# Altium schematic sheet DC TO DC.SchDoc: DC TO DC CONVERTER
size A4; Date: 08/11/2025; CompanyName: MR; DrawnBy: Rajasekhar; SheetNumber: 1; SheetTotal: 1
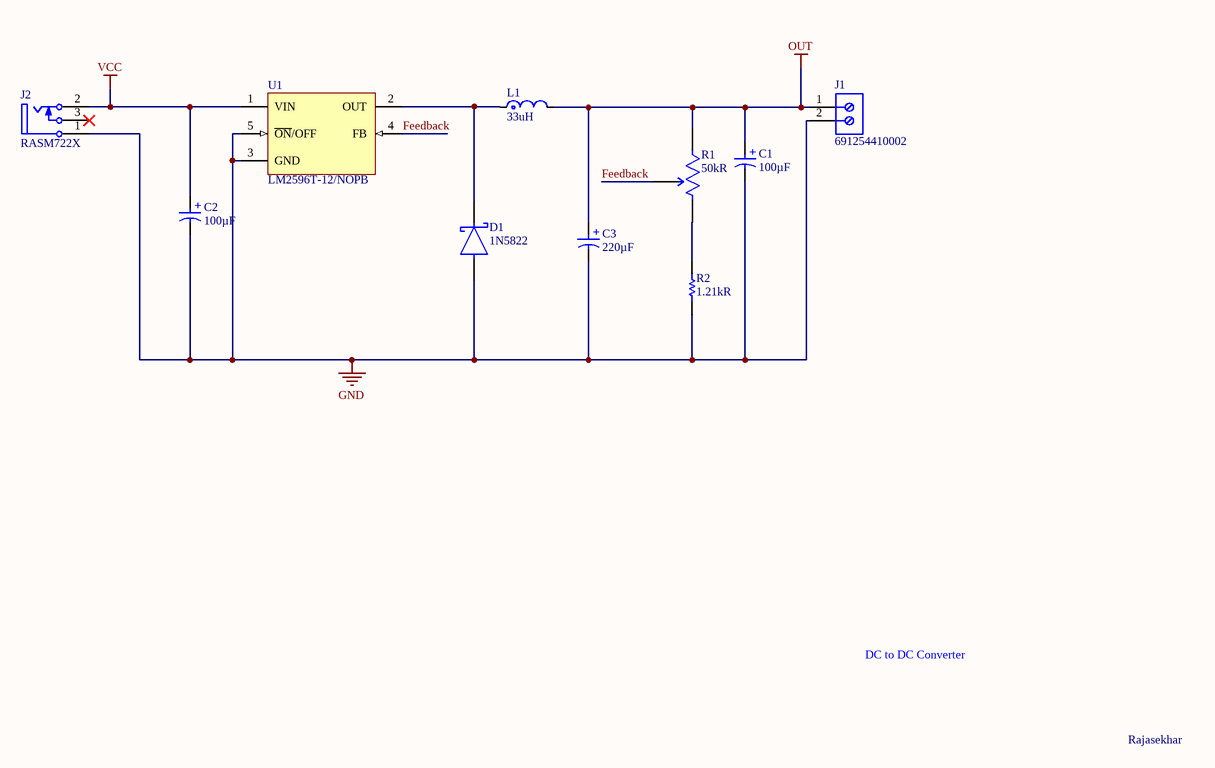
[diagram p0: DC TO DC.SchDoc]

## Parts
C1  Capacitance: 100µF  [WCAP-ATET_D13H25]  (hidden comment: 860130878011)
C2  Capacitance: 100µF  [WCAP-ATET_D13H25]  (hidden comment: 860130878011)
C3  Capacitance: 220µF  [WCAP-ATLL_D8H11.5]  (hidden comment: 860160374017)
D1  1N5822  [FP-DO-201AD-MFG]
J1  691254410002  [691254410002]
J2  RASM722X  [SWIT-RASM722X_V]
L1  Inductance: 33uH  [FP-DS75LC-MFG]  (hidden comment: B1047AS-330M=P3)
R1  Resistance: 50kR  [FP-3362P-1-503TLF-MFG]  (hidden comment: 3362P-1-503TLF)
R2  value 1.21kR  [RESC1608X55X25LL10T15]  (hidden comment: RC0603FR-071K21L)
U1  LM2596T-12/NOPB  [NDH0005A]

## Nets
GND: C1.2(N) C2.2(N) C3.2(N) D1.2(A) J1.2 J2.1(SLEEVE) R2.1 U1.3(GND) U1.5(~{ON}/OFF)
OUT: C1.1(P) C3.1(P) J1.1 L1.2 R1.1(CCW)
VCC: C2.1(P) J2.2(TIP) U1.1(VIN)
Feedback: R1.2(WIPER) U1.4(FB)
NetD1_1: D1.1(C) L1.1 U1.2(OUT)
NetR1_3: R1.3(CW) R2.2

Not connected (* = marked no-connect by the designer): J2 3(SHUNT)*

## Notes on the sheet
- DC to DC Converter
- Rajasekhar
- (in symbol CMP-03913-54218110-1) +
- (in symbol CMP-03913-55434149-1) +

## Library data of the parts
C1 C2 = CMP-03913-54218110-1: 860130878011 WCAP-ATET Aluminum Electrolytic Capacitors; Polarity: Polar; Pitch: 5mm; Ripple Current: 270mA; Voltage Rating: 100V; Leakage Current: 100µA; Life (Hours): 2000hours; Tolerance: 20%; Packaging: Tape & Box (TB); RoHS: Compliant; Max Operating Temperature: 125°C; Lead Pitch: 5.0038mm; Length: 25mm; Diameter: 13mm; Mount: Through Hole; NexarPartId: 54218110; Height - Seated (Max): 26.4922mm; Case/Package: Radial; Min Operating Temperature: -40°C
C3 = CMP-03913-55434149-1: 860160374017 Aluminium Electrolytic Capacitor-Leaded Rohs Compliant: Yes; Pitch: 3.5mm; Leakage Current: 35.2µA; Ripple Current: 540mA; Voltage Rating: 16V; Length: 11.5mm; NexarPartId: 55434149; Diameter: 8mm; RoHS: Non-Compliant
D1 = CMP-12187-000025-1: DIODE SCHOTTKY 40V 3A DO201AD; Manufacturer: STMicroelectronics; Max Junction Temp: +150°C; Peak Reverse Current: 2mA; Max Surge Forward Current: 80A; Temperature Range High: +150°C; Automotive: No; RoHS: TRUE; ComponentLink2Description: Datasheet; Manufacturer Part Number: 1N5822; Lead Free: Yes; Octopart: https://octopart.com/1n5822-stmicroelectronics-323225; Device Class L2: Diodes; Max Repetitive Reverse Voltage: 40V; Temperature: to +150°C; Height: 5.3mm; Category: Diode; Digikey Description: DIODE SCHOTTKY 40V 3A DO201AD; ComponentLink2URL: https://www.st.com/resource/en/datasheet/1n5822.pdf; Device Class L3: Schottky Diodes; Device Class L1: Discrete Semiconductors; Forward Current: 3A; Mouser Description: Schottky Diodes & Rectifiers Vr/40V Io/3A BULK; Package: DO-201AD
J1 = CMP-1502-02748-2: NexarPartId: 105950827
J2 = CMP-002-00013-2: Power Jack, 5 A, 250 V, 3-Pin SMD, RoHS, Bulk; Manufacturer: Switchcraft; Connector Type: DCJack; Package Reference: RASM722X; Mounting Technology: SM; Manufacturer URL: http://www.switchcraft.com/; Datasheet URL: http://www.switchcraft.com/Drawings/rasm732x_cd.pdf; RoHS Compliant: Unknown; Datasheet Version: Rev. A, 09/2005; Package Description: 3-Pin Surface Mount Device, Body 14.5 x 9 mm; Case/Package: RASM722X
L1 = CMP-06042-002233-1: Shielded Wirewound Inductor 33uH 20% 1500mA 0.17Ω SMD; Current Rating: 1.5A; Test Frequency: 100kHz; DC Resistance (DCR): 170mR; Saturation Current: 1.64A; Core Material: Ferrite; Resistor Type: Wirewound; Tolerance: 20%; Shielding: Shielded; Max Operating Temperature: 85°C; Min Operating Temperature: -40°C; Mount: Surface Mount; Height - Seated (Max): 0.197inch; Length: 0.299inch; Packaging: Tape and Reel; Case/Package: Nonstandard; Width: 0.299inch
R1 = CMP-07234-000028-1: TRIMMER 50K OHM 0.5W PC PIN TOP; Temperature Coefficient: 100ppm/°C; Voltage Rating (DC): 300V; Power Rating: 500mW; Tolerance: 10%; Number of Turns: 1; Series: Trimpot® 3362 - Sealed; Military Standard: Not; Termination: Pin; Technology: CERMET; Depth: 7.04mm; RoHS Compliant: Yes; Max Operating Temperature: 125°C; Lead Free: Lead Free; Max Power Dissipation: 500mW; REACH SVHC: No SVHC; Min Operating Temperature: -55°C; Resistor Type: Cermet; Height: 0.185inch; Width: 4.7mm; Mount: Through Hole; Weight: 0.02oz; Length: 6.6mm; Resistance Tolerance: 10%; Package Quantity: 50; Radiation Hardening: No; Packaging: Rail/Tube
R2 = CMP-2000-03933-1: Manufacturer: Yageo; Part Number: RC0603FR-071K21L
U1 = CMP-0069-01925-3: SIMPLE SWITCHER® Power Converter 150 KHz 3A Step-Down Voltage Regulator, 5-pin TO-220, Pb-Free; Manufacturer: Texas Instruments; PackageTopMarking: NSUZXYTTE#*LM2596T*-12 P+; PowerWise: N; RoHS: Y; ComponentLink1URL: http://www.ti.com/general/docs/lit/getliterature.tsp?genericPartNumber=LM2596&fileType=pdf; CompType: Switcher; ComponentLink1Description: Datasheet URL; PackageReference: NDH0005A; PinCount: 5; PackageDescription: TO-220, Molded, Stagger Bend, 5 Lead